# EAGLE design imu (EAGLE 5.06)
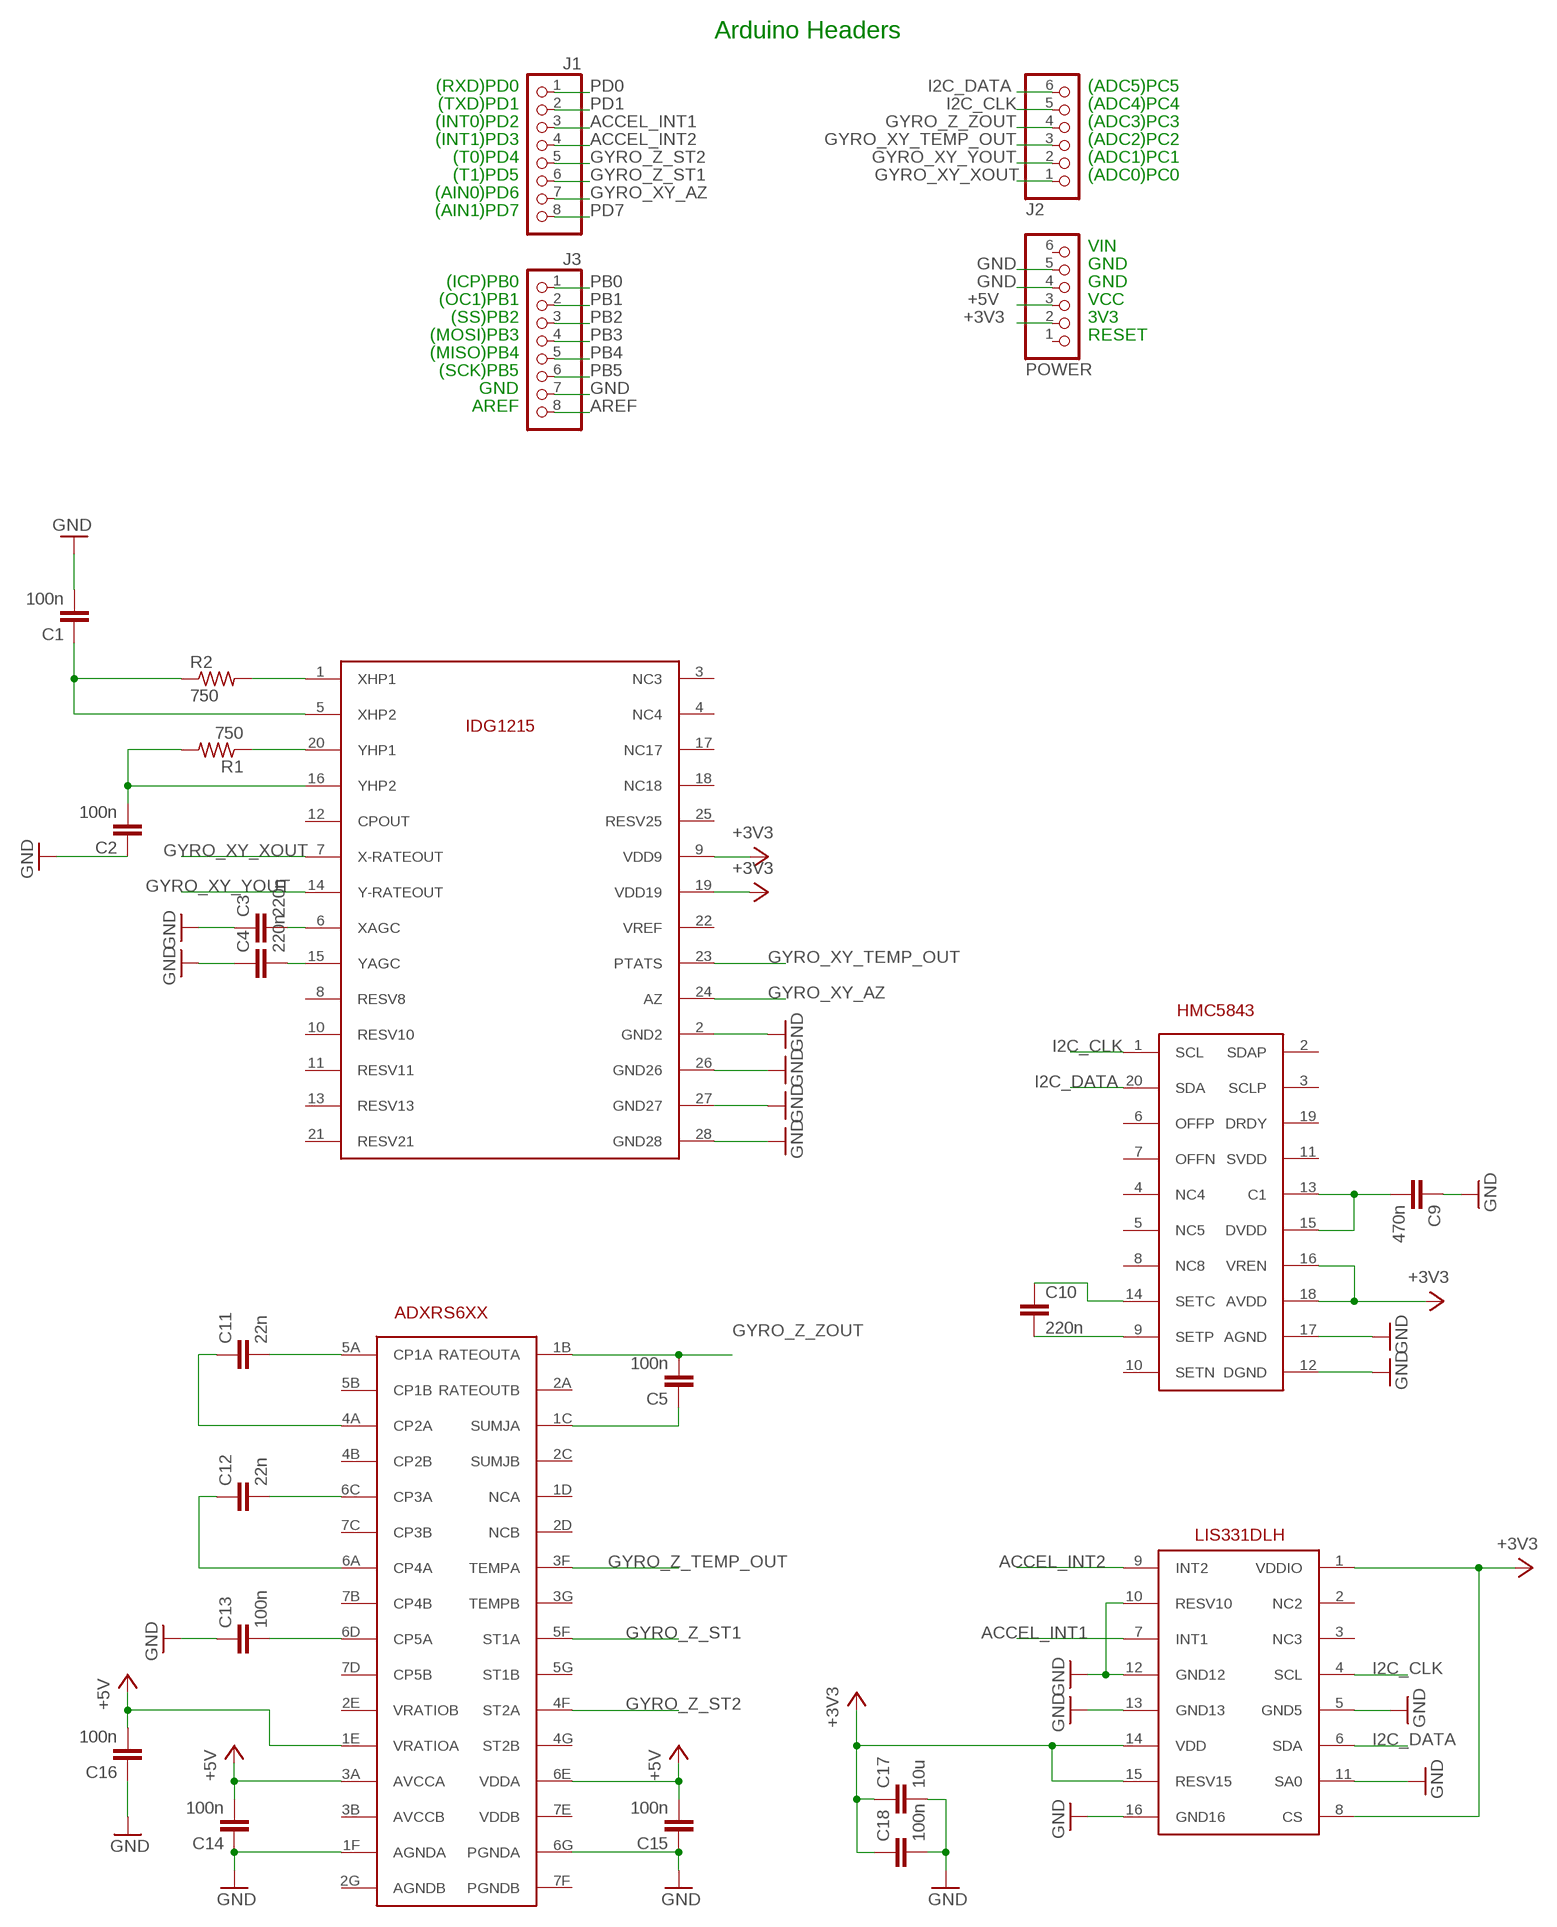
[diagram p0: schematic, sheet 1]

## Parts
C1  100n  C-EUC0603  [C0603]
C2  100n  C-EUC0603  [C0603]
C3  220n  C-EUC0603  [C0603]
C4  220n  C-EUC0603  [C0603]
C5  100n  C-EUC0603  [C0603]
C9  470n  C-EUC0603  [C0603]
C10  220n  C-EUC0603  [C0603]
C11  22n  C-EUC0603  [C0603]
C12  22n  C-EUC0603  [C0603]
C13  100n  C-EUC0603  [C0603]
C14  100n  C-EUC0603  [C0603]
C15  100n  C-EUC0603  [C0603]
C16  100n  C-EUC0603  [C0603]
C17  10u  C-EUC0603  [C0603]
C18  100n  C-EUC0603  [C0603]
J1  PINHD-1X8  [1X08]
J2  PINHD-1X6  [1X06]
J3  PINHD-1X8  [1X08]
POWER  PINHD-1X6  [1X06]
R1  750  R-US_R0603  [R0603]
R2  750  R-US_R0603  [R0603]
U$2  HMC5843HMC5843_V2  [HMC5843]
U$3  IDG1215  [IDG1215]
U$4  ADXRS6XX  [ADXRS6XX]
U$5  LIS331DLH  [LIS331DLH]

## Nets
+3V3: C17.1 C18.1 POWER.2 U$2.16(VREN) U$2.18(AVDD) U$3.9(VDD9) U$3.19(VDD19) U$5.1(VDDIO) U$5.8(CS) U$5.14(VDD) U$5.15(RESV15)
+5V: C14.2 C15.2 C16.2 POWER.3 U$4.1E(VRATIOA) U$4.3A(AVCCA) U$4.6E(VDDA)
ACCEL_INT1: J1.3 U$5.7(INT1)
ACCEL_INT2: J1.4 U$5.9(INT2)
AREF: J3.8
GND: C1.2 C2.1 C3.1 C4.1 C9.1 C13.1 C14.1 C15.1 C16.1 C17.2 C18.2 J3.7 POWER.4 POWER.5 U$2.12(DGND) U$2.17(AGND) U$3.2(GND2) U$3.26(GND26) U$3.27(GND27) U$3.28(GND28) U$4.1F(AGNDA) U$4.6G(PGNDA) U$5.5(GND5) U$5.10(RESV10) U$5.11(SA0) U$5.12(GND12) U$5.13(GND13) U$5.16(GND16)
GYRO_XY_AZ: J1.7 U$3.24(AZ)
GYRO_XY_TEMP_OUT: J2.3 U$3.23(PTATS)
GYRO_XY_XOUT: J2.1 U$3.7(X-RATEOUT)
GYRO_XY_YOUT: J2.2 U$3.14(Y-RATEOUT)
GYRO_Z_ST1: J1.6 U$4.5F(ST1A)
GYRO_Z_ST2: J1.5 U$4.4F(ST2A)
GYRO_Z_TEMP_OUT: U$4.3F(TEMPA)
GYRO_Z_ZOUT: C5.2 J2.4 U$4.1B(RATEOUTA)
I2C_CLK: J2.5 U$2.1(SCL) U$5.4(SCL)
I2C_DATA: J2.6 U$2.20(SDA) U$5.6(SDA)
N$1: C3.2 U$3.6(XAGC)
N$2: C4.2 U$3.15(YAGC)
N$3: R1.1 U$3.20(YHP1)
N$4: C2.2 R1.2 U$3.16(YHP2)
N$5: R2.2 U$3.1(XHP1)
N$6: C1.1 R2.1 U$3.5(XHP2)
N$7: C10.2 U$2.9(SETP)
N$14: C10.1 U$2.14(SETC)
N$16: C9.2 U$2.13(C1) U$2.15(DVDD)
N$21: C11.2 U$4.5A(CP1A)
N$22: C11.1 U$4.4A(CP2A)
N$23: C12.2 U$4.6C(CP3A)
N$24: C12.1 U$4.6A(CP4A)
N$26: C13.2 U$4.6D(CP5A)
N$30: C5.1 U$4.1C(SUMJA)
PB0: J3.1
PB1: J3.2
PB2: J3.3
PB3: J3.4
PB4: J3.5
PB5: J3.6
PD0: J1.1
PD1: J1.2
PD7: J1.8
Unconnected: POWER.1 POWER.6 U$2.2(SDAP) U$2.3(SCLP) U$2.4(NC4) U$2.5(NC5) U$2.6(OFFP) U$2.7(OFFN) U$2.8(NC8) U$2.10(SETN) U$2.11(SVDD) U$2.19(DRDY) U$3.3(NC3) U$3.4(NC4) U$3.8(RESV8) U$3.10(RESV10) U$3.11(RESV11) U$3.12(CPOUT) U$3.13(RESV13) U$3.17(NC17) U$3.18(NC18) U$3.21(RESV21) U$3.22(VREF) U$3.25(RESV25) U$4.1D(NCA) U$4.2A(RATEOUTB) U$4.2C(SUMJB) U$4.2D(NCB) U$4.2E(VRATIOB) U$4.2G(AGNDB) U$4.3B(AVCCB) U$4.3G(TEMPB) U$4.4B(CP2B) U$4.4G(ST2B) U$4.5B(CP1B) U$4.5G(ST1B) U$4.7B(CP4B) U$4.7C(CP3B) U$4.7D(CP5B) U$4.7E(VDDB) U$4.7F(PGNDB) U$5.2(NC2) U$5.3(NC3)

## Notes on the sheet
- Arduino Headers
- (RXD)PD0 | (ADC5)PC5
- (TXD)PD1 | (ADC4)PC4
- (INT0)PD2 | (ADC3)PC3
- (INT1)PD3 | (ADC2)PC2
- (T0)PD4 | (ADC1)PC1
- (T1)PD5 | (ADC0)PC0
- (AIN0)PD6
- (AIN1)PD7
- VIN
- GND
- (ICP)PB0 | GND
- (OC1)PB1 | VCC
- (SS)PB2 | 3V3
- (MOSI)PB3 | RESET
- (MISO)PB4
- (SCK)PB5
- GND
- AREF

## Library data of the parts
C1-C5 C9-C18 = rcl:C-EU: CAPACITOR, European symbol
J1 J3 = pinhead:PINHD-1X8: PIN HEADER
J2 POWER = pinhead:PINHD-1X6: PIN HEADER
R1 R2 = rcl:R-US_: RESISTOR, American symbol
U$2 = HMC5843:HMC5843
U$3 = IDG1215:IDG1215
U$4 = ADXRS6XX:ADXRS6XX
U$5 = LIS331DLH:LIS331DLH

## Board
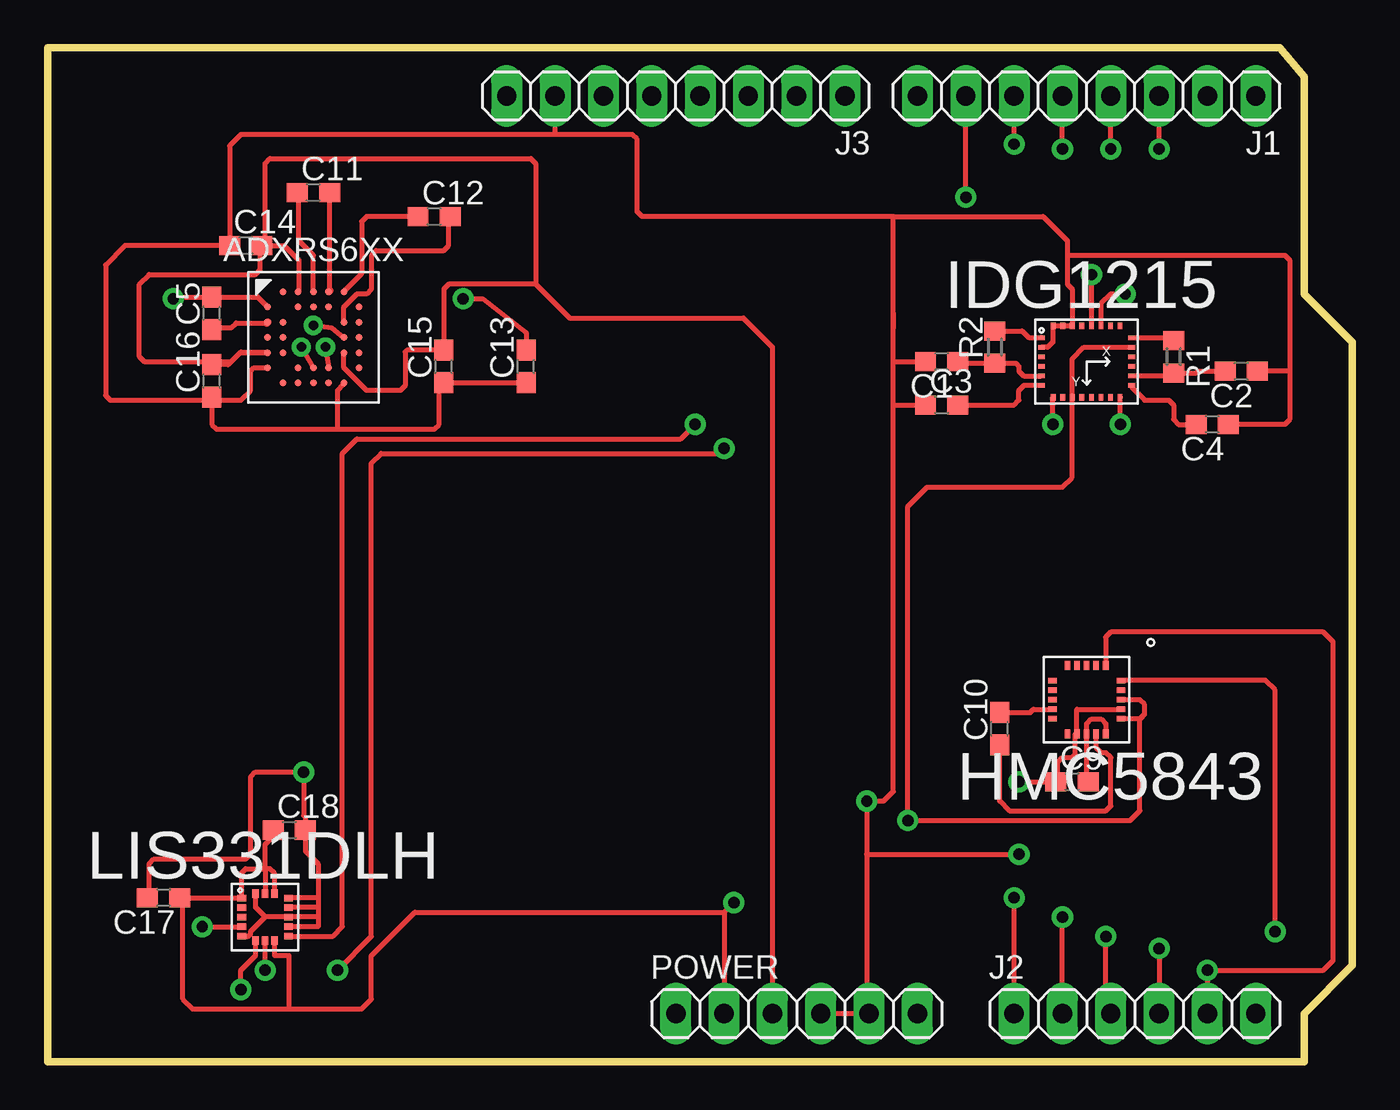
[diagram p1: board, top side]
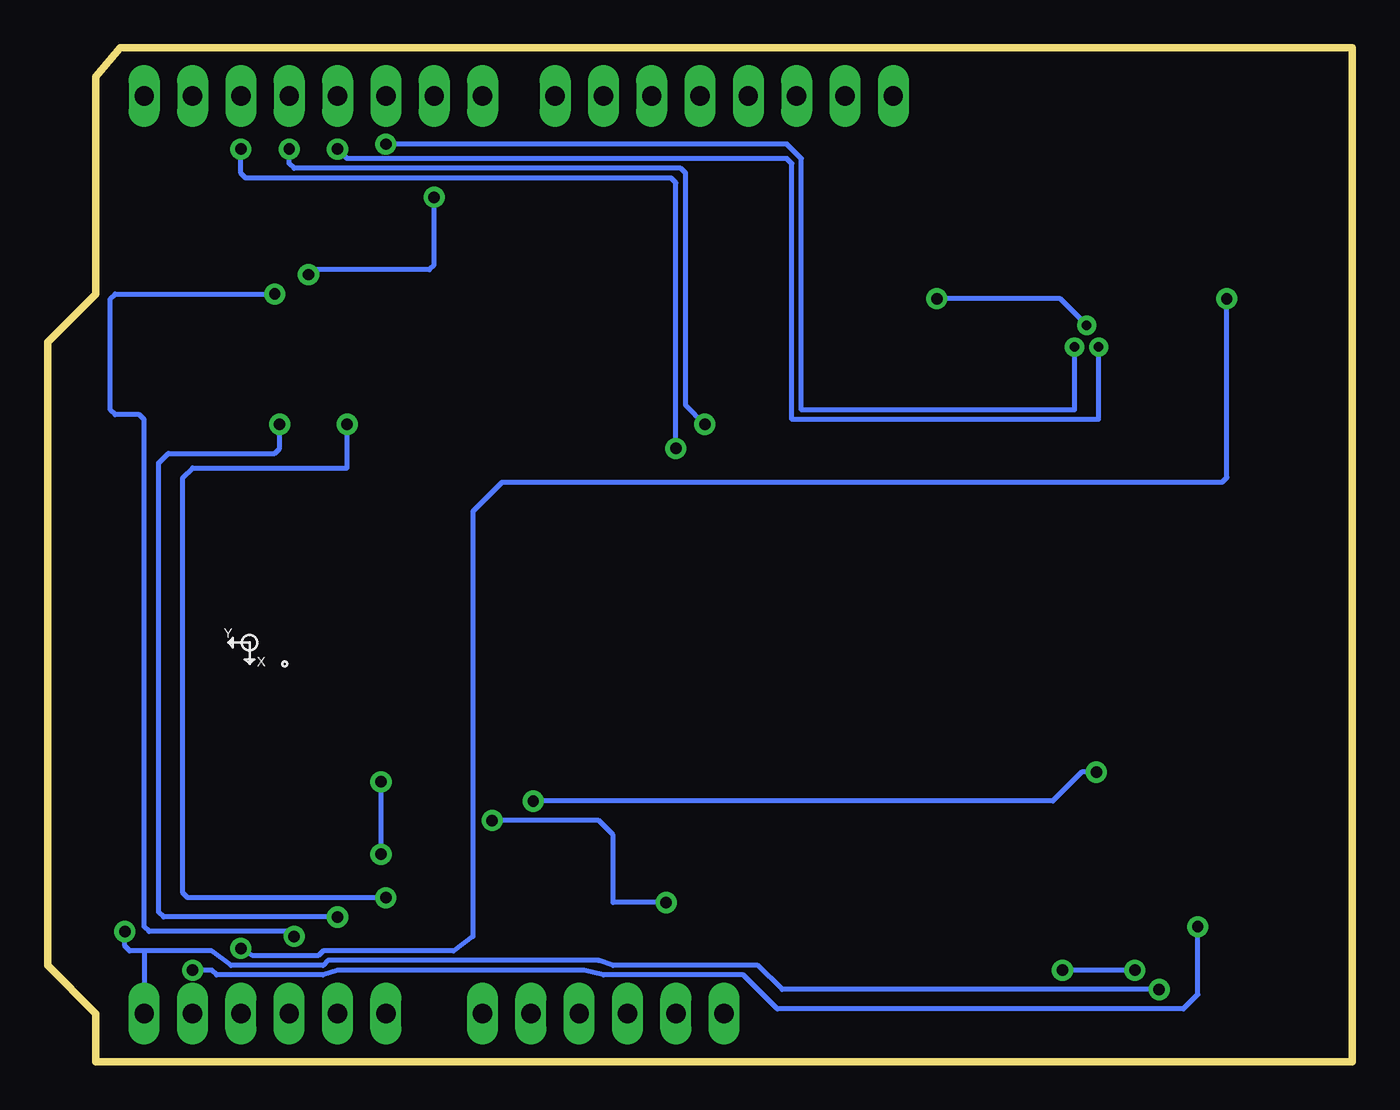
[diagram p2: board, bottom side, seen from below]

Size 68.58 x 53.34 mm. Coordinates in mm from the lower left corner, seen from the top.
Outline: 0,53.34 64.77,53.34 66.04,51.82 66.04,40.39 68.58,37.85 68.58,5.08 66.04,2.54 66.04,0 0,0 0,53.34
Copper layers (1*16): Top 0.035mm / dielectric 1.5mm / Bottom 0.035mm
Design rules "SparkFun": minimum track width 8mil, minimum drill 20mil, track to track 8mil, track to pad 8mil, pad to pad 8mil, via to via 8mil, smd to smd 8mil, copper to edge 10mil, drill to drill 8mil, minimum pad ring 12mil, minimum via ring 10mil, stop-mask expansion 4mil, vias tented up to drill 25mil, thermal gap 10mil

### Footprints (pad centres in the part's own frame; a part is rotated, then mirrored left to right if it is on the bottom)
C0603 = smd 1.1 x 1: 1 -0.85,0; 2 0.85,0
1X08 = drill 1.016 long: 1 -8.89,0; 2 -6.35,0; 3 -3.81,0; 4 -1.27,0; 5 1.27,0; 6 3.81,0; 7 6.35,0; 8 8.89,0
1X06 = drill 1.016 long: 1 -6.35,0; 2 -3.81,0; 3 -1.27,0; 4 1.27,0; 5 3.81,0; 6 6.35,0
R0603 = smd 1 x 1.1: 1 -0.85,0; 2 0.85,0
HMC5843 = smd 0.3 x 0.45: 1 1,1.8; 2 0.5,1.8; 3 0,1.8; 4 -0.5,1.8; 5 -1,1.8; 11 -1,-1.8; 12 -0.5,-1.8; 13 0,-1.8; 14 0.5,-1.8; 15 1,-1.8 | smd 0.45 x 0.3: 6 -1.8,1; 7 -1.8,0.5; 8 -1.8,0; 9 -1.8,-0.5; 10 -1.8,-1; 16 1.8,-1; 17 1.8,-0.5; 18 1.8,0; 19 1.8,0.5; 20 1.8,1
IDG1215 = smd 0.35 x 0.25: 1 -2.375,1.25; 2 -2.375,0.75; 3 -2.375,0.25; 4 -2.375,-0.25; 5 -2.375,-0.75; 6 -2.375,-1.25; 15 2.375,-1.25; 16 2.375,-0.75; 17 2.375,-0.25; 18 2.375,0.25; 19 2.375,0.75; 20 2.375,1.25 | smd 0.25 x 0.35: 7 -1.75,-1.875; 8 -1.25,-1.875; 9 -0.75,-1.875; 10 -0.25,-1.875; 11 0.25,-1.875; 12 0.75,-1.875; 13 1.25,-1.875; 14 1.75,-1.875; 21 1.75,1.875; 22 1.25,1.875; 23 0.75,1.875; 24 0.25,1.875; 25 -0.25,1.875; 26 -0.75,1.875; 27 -1.25,1.875; 28 -1.75,1.875
ADXRS6XX = smd 0.36 x 0.36: 1B -2.4,1.6; 1C -2.4,0.8; 1D -2.4,0; 1E -2.4,-0.8; 1F -2.4,-1.6; 2A -1.6,2.4; 2C -1.6,0.8; 2D -1.6,0; 2E -1.6,-0.8; 2G -1.6,-2.4; 3A -0.8,2.4; 3B -0.8,1.6; 3F -0.8,-1.6; 3G -0.8,-2.4; 4A 0,2.4; 4B 0,1.6; 4F 0,-1.6; 4G 0,-2.4; 5A 0.8,2.4; 5B 0.8,1.6; 5F 0.8,-1.6; 5G 0.8,-2.4; 6A 1.6,2.4; 6C 1.6,0.8; 6D 1.6,0; 6E 1.6,-0.8; 6G 1.6,-2.4; 7B 2.4,1.6; 7C 2.4,0.8; 7D 2.4,0; 7E 2.4,-0.8; 7F 2.4,-1.6
LIS331DLH = smd 0.45 x 0.35: 1 -1.225,1; 2 -1.225,0.5; 3 -1.225,0; 4 -1.225,-0.5; 5 -1.225,-1; 9 1.225,-1; 10 1.225,-0.5; 11 1.225,0; 12 1.225,0.5; 13 1.225,1 | smd 0.35 x 0.45: 6 -0.5,-1.225; 7 0,-1.225; 8 0.5,-1.225; 14 0.5,1.225; 15 0,1.225; 16 -0.5,1.225

### Placement (x,y rotation side)
C1  46.99,36.83 180 top
C2  62.74,36.32 180 top
C3  46.99,34.54 0 top
C4  61.21,33.53 180 top
C5  8.64,39.37 90 top
C9  53.85,14.73 0 top
C10  50.04,17.53 90 top
C11  13.97,45.72 0 top
C12  20.32,44.45 0 top
C13  25.15,36.58 90 top
C14  10.41,42.93 0 top
C15  20.83,36.58 90 top
C16  8.64,35.81 90 top
C17  6.1,8.64 180 top
C18  12.7,12.19 0 top
J1  54.61,50.8 180 top
J2  57.15,2.54 0 top
J3  33.02,50.8 180 top
POWER  39.37,2.54 0 top
R1  59.18,37.08 270 top
R2  49.78,37.59 90 top
U$2  54.61,19.05 0 top
U$3  54.61,36.83 0 top
U$4  13.97,38.1 0 top
U$5  11.43,7.62 0 top

### Tracks (layer width: path | path; a pad name or v marks a point on that pad's centre or on a via)
+3V3  (via drill 0.6)
  Top 0.254: 56.41,18.03 U$2.16 57.42,18.05 57.66,18.29 | U$5.8 11.94,5.59 12.7,5.59 12.7,2.79 | U$5.14 11.93,9.9 11.94,9.91 11.68,10.16 11.43,10.16 | 11.43,10.16 U$5.15 | U$3.19 54.47,37.58 53.85,36.96 53.85,34.97 U$3.9 53.85,34.94 53.85,30.73 53.34,30.23 46.23,30.23 45.21,29.21 v45.21,12.7 56.9,12.7 57.4,13.21 57.4,18.03 57.66,18.29 | 12.7,2.79 16.51,2.79 17.02,3.3 17.02,5.59 19.3,7.87 35.56,7.87 | 11.43,10.16 10.41,10.16 10.21,9.95 U$5.1 10.19,8.64 C17.1 7.11,8.47 7.11,3.3 7.62,2.79 12.7,2.79 | 35.56,7.87 POWER.2 | 35.56,7.87 v36.07,8.38 | C18.1 11.85,11.85 11.43,11.43 11.43,10.16 | U$2.18 57.4,19.05 57.66,18.8 57.66,18.29
  Bottom 0.254: v36.07,8.38 38.86,8.38 38.86,11.94 39.62,12.7 v45.21,12.7
+5V
  Top 0.254: POWER.3 38.1,37.59 36.58,39.12 27.43,39.12 25.65,40.89 | U$4.6E 15.57,36.5 16.76,35.31 18.54,35.31 18.8,35.56 18.8,37.34 18.88,37.43 C15.2 20.83,40.64 21.08,40.89 25.65,40.89 | C16.2 9.49,36.66 9.65,36.83 | 10.16,37.34 11.53,37.34 U$4.1E 10.2,37.3 10.16,37.34 | 11.43,42.93 C14.2 11.18,42.84 11.18,41.66 10.92,41.4 5.33,41.4 4.83,40.89 4.83,37.08 5.08,36.83 9.65,36.83 | 11.43,42.93 11.43,47.24 11.68,47.5 25.4,47.5 25.65,47.24 25.65,40.89 | 11.43,42.93 12.45,42.93 13.21,42.16 13.21,40.54 U$4.3A | 9.65,36.83 10.16,37.34
ACCEL_INT1  (via drill 0.6)
  Top 0.254: v11.43,4.83 U$5.7 | v58.42,48.01 J1.3 | v35.56,32.26 35.31,32 17.53,32 17.02,31.5 17.02,6.6 v15.24,4.83
  Bottom 0.254: v58.42,48.01 58.42,46.74 58.17,46.48 35.81,46.48 35.56,46.23 v35.56,32.26 | v11.43,4.83 v15.24,4.83
ACCEL_INT2  (via drill 0.6)
  Top 0.254: v55.88,48.01 J1.4 | v34.04,33.53 33.27,32.77 16.26,32.77 15.49,32 15.49,7.11 15,6.62 U$5.9
  Bottom 0.254: v55.88,48.01 55.88,47.24 55.63,46.99 35.31,46.99 35.05,46.74 35.05,34.54 v34.04,33.53
GND  (via drill 0.6)
  Top 0.254: POWER.4 POWER.5 43.05,2.67 43.05,10.92 | U$3.26 53.85,38.7 | U$3.27 53.34,38.7 | U$3.28 52.83,38.7 | U$5.10 12.66,7.11 14.22,7.11 14.22,7.62 | 14.22,7.62 U$5.11 11.43,7.62 | U$5.12 12.66,8.13 14.22,8.13 | 14.22,8.13 14.22,7.62 | 14.22,8.64 14.22,8.13 | 20.57,35.47 20.57,33.53 20.32,33.27 15.24,33.27 | U$2.17 54.11,18.55 54.1,18.54 U$2.12 54.01,17.25 54.01,16.17 53.85,16 53.34,16 53.09,15.75 53.09,14.82 C9.1 v51.05,14.73 | 26.67,48.77 J3.7 | 44.45,44.45 31.24,44.45 30.99,44.7 30.99,48.51 30.73,48.77 26.67,48.77 | 44.45,44.45 52.32,44.45 53.59,43.18 53.59,42.42 | U$4.6G 15.57,35.64 15.24,35.31 15.24,33.27 | 43.05,10.92 v43.05,13.72 43.94,13.72 44.45,14.22 44.45,34.54 | U$5.16 10.93,8.12 11.43,7.62 | U$5.13 14.21,8.62 14.22,8.64 | U$3.2 52.57,37.58 52.83,37.85 52.83,38.68 U$3.28 | U$3.27 U$3.28 | U$3.26 U$3.27 | 53.59,42.42 53.59,40.89 53.85,40.64 53.85,38.72 U$3.26 | C15.1 C13.1 25.23,35.81 | U$4.1F 10.85,36.5 10.67,36.32 10.67,35.31 10.16,34.8 8.8,34.8 C16.1 | 15.24,33.27 8.89,33.27 8.64,33.53 C16.1 | 26.67,48.77 10.16,48.77 9.56,48.17 C14.1 4.06,42.93 3.05,41.91 3.05,35.05 3.3,34.8 8.47,34.8 C16.1 | 14.22,8.64 14.22,10.41 13.55,11.09 C18.2 13.55,12.87 13.46,12.95 v13.46,15.24 10.92,15.24 10.67,14.99 10.67,10.92 10.41,10.67 5.59,10.67 5.33,10.41 5.33,8.72 | 44.45,39.37 44.45,44.45 | 44.45,39.37 44.45,38.61 | 43.05,10.92 v51.05,10.92 | 44.45,34.54 44.45,36.83 | 44.45,36.83 44.45,39.37 | 5.33,8.72 5.59,8.98 | C17.2 5.33,8.72 | C4.1 65.02,33.53 65.28,33.78 65.28,36.32 | 65.28,36.32 65.28,42.16 65.02,42.42 53.59,42.42 | 65.28,36.32 C2.1 | 44.45,36.83 C1.2 | 44.45,34.54 C3.1 | U$5.5 10.56,6.62 10.67,6.73 10.67,6.86 11.43,7.62
  Top 0.406: 20.57,35.47 C15.1
  Bottom 0.254: v43.05,13.72 15.75,13.72 14.22,15.24 v13.46,15.24 | v51.05,10.92 v51.05,14.73
GYRO_XY_AZ  (via drill 0.6)
  Top 0.254: v48.26,45.47 J1.7 | U$3.24 v54.86,41.4
  Bottom 0.254: v54.86,41.4 54.61,41.66 48.51,41.66 48.26,41.91 v48.26,45.47
GYRO_XY_TEMP_OUT  (via drill 0.6)
  Top 0.254: 55.63,2.54 v55.63,6.6 | U$3.23 55.36,39.87 55.88,40.39 v56.64,40.39
  Top 0.406: 55.63,2.54 J2.3
  Bottom 0.254: v55.63,6.6 55.88,6.86 63.25,6.86 63.5,7.11 63.5,33.78 63.75,34.04 65.02,34.04 65.28,34.29 65.28,40.13 65.02,40.39 v56.64,40.39
GYRO_XY_XOUT  (via drill 0.6)
  Top 0.254: J2.1 v50.8,8.64 | U$3.7 52.83,34.95 v52.83,33.53
  Bottom 0.254: v52.83,33.53 52.83,31.24 60.96,31.24 61.47,30.73 61.47,8.89 61.21,8.64 v50.8,8.64
GYRO_XY_YOUT  (via drill 0.6)
  Top 0.254: J2.2 v53.34,7.62 | U$3.14 56.39,34.95 v56.39,33.53
  Bottom 0.254: v53.34,7.62 62.48,7.62 62.74,7.87 62.74,31.5 62.23,32 56.64,32 56.39,32.26 v56.39,33.53
GYRO_Z_ST1  (via drill 0.5, 0.6)
  Top 0.254: v50.8,48.26 J1.6 | v14.61,37.59 U$4.5F
  Bottom 0.254: v14.61,37.59 14.61,34.29 28.96,34.29 28.96,47.5 29.72,48.26 v50.8,48.26
GYRO_Z_ST2  (via drill 0.5, 0.6)
  Top 0.254: v53.34,48.01 J1.5 | v13.34,37.59 U$4.4F
  Bottom 0.254: v13.34,37.59 13.34,33.78 29.46,33.78 29.46,47.24 29.72,47.5 52.83,47.5 v53.34,48.01
GYRO_Z_ZOUT  (via drill 0.6)
  Top 0.254: v58.42,5.97 J2.4 | U$4.1B 11.05,40.22 C5.2 6.69,40.22 v6.6,40.13
  Bottom 0.254: v58.42,5.97 57.78,5.59 54.36,5.59 54.1,5.84 47.24,5.84 46.23,6.6 46.23,28.96 44.7,30.48 6.86,30.48 6.6,30.73 v6.6,40.13
I2C_CLK  (via drill 0.6)
  Top 0.254: J2.5 v60.96,4.83 67.06,4.83 67.56,5.33 67.56,22.1 67.06,22.61 55.88,22.61 55.61,22.34 U$2.1 | v8.13,7.11 10.2,7.11 U$5.4
  Bottom 0.254: v60.96,4.83 59.94,4.83 59.69,4.57 54.1,4.57 53.34,4.83 40.39,4.83 39.37,4.57 32,4.57 30.23,2.79 8.89,2.79 8.13,3.56 v8.13,7.11
I2C_DATA  (via drill 0.6)
  Top 0.254: 56.41,20.07 U$2.20 56.43,20.07 64.01,20.07 64.52,19.56 v64.52,6.86 | U$5.6 10.93,5.6 10.16,4.83 v10.16,3.81
  Bottom 0.254: v10.16,3.81 29.97,3.81 31.24,5.08 38.86,5.08 39.62,5.33 53.85,5.33 54.1,5.08 58.93,5.08 59.94,5.84 63.5,5.84 | 63.5,5.84 J2.6 | 63.5,5.84 64.26,5.84 64.52,6.1 v64.52,6.86
N$1
  Top 0.254: U$3.6 51.33,35.58 51.05,35.31 51.05,34.8 50.8,34.54 C3.2
N$2
  Top 0.254: U$3.15 56.98,35.47 57.66,34.8 58.93,34.8 59.18,34.54 59.18,33.78 59.44,33.53 C4.2
N$3
  Top 0.254: U$3.20 59.04,38.08 R1.1
N$4
  Top 0.254: U$3.16 59.03,36.08 R1.2 60.36,36.23 60.45,36.32 C2.2
N$5
  Top 0.254: 52.23,38.1 U$3.1 52.22,38.1 51.56,38.1 51.22,38.44 R2.2
N$6
  Top 0.254: U$3.5 52.22,36.07 51.31,36.07 51.05,36.32 51.05,36.58 50.89,36.74 R2.1 47.93,36.74 C1.1
N$7
  Top 0.254: C10.2 51.65,18.38 51.82,18.54 U$2.9
N$14
  Top 0.254: U$2.14 55.12,16.51 55.37,16.26 55.63,16.26 55.88,16 55.88,13.46 55.63,13.21 50.55,13.21 50.04,13.72 C10.1
N$16
  Top 0.254: U$2.15 55.61,17.76 55.63,17.78 55.37,18.03 54.86,18.03 54.61,17.78 U$2.13 54.61,14.82 C9.2
N$21
  Top 0.254: 14.82,40.55 C11.2
  Top 0.406: U$4.5A 14.82,40.55
N$22
  Top 0.254: 13.21,45.63 13.21,43.18 13.97,42.42 U$4.4A
  Top 0.406: 13.21,45.63 C11.1
N$23
  Top 0.254: U$4.6C 15.57,39.7 16.26,40.39 16.76,40.39 17.02,40.64 17.02,42.42 17.27,42.67 20.83,42.67 21.08,42.93 21.08,44.36 C12.2
N$24
  Top 0.254: U$4.6A 16.51,41.44 16.51,44.2 16.76,44.45 C12.1
N$26  (via drill 0.5, 0.6)
  Top 0.254: U$4.6D 14.94,38.61 v13.97,38.73 | C13.2 25.15,38.35 22.86,40.13 v21.84,40.13
  Bottom 0.254: v13.97,38.73 15.37,40.13 v21.84,40.13
N$30
  Top 0.254: 11.53,38.86 9.91,38.86 9.65,38.61 8.72,38.61 C5.1
  Top 0.406: 11.53,38.86 U$4.1C